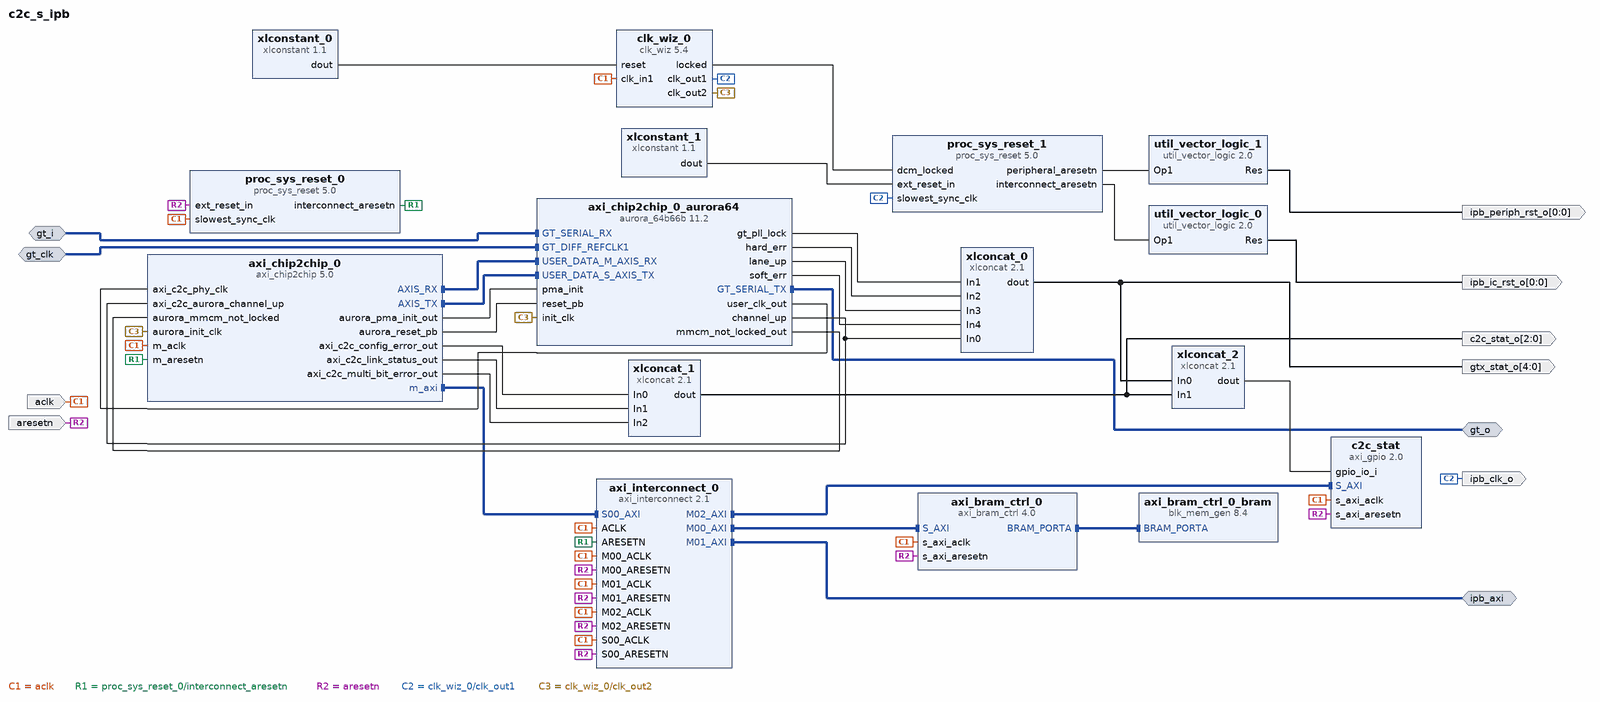
[diagram p0: block diagram of the top level]
# Vivado block design c2c_s_ipb, xczu9eg-ffvb1156-2-e, Vivado 2017.4.1
create_bd_design c2c_s_ipb

create_bd_intf_port -mode Master -vlnv xilinx.com:display_aurora:GT_Serial_Transceiver_Pins_TX_rtl:1.0 gt_o
create_bd_intf_port -mode Slave -vlnv xilinx.com:display_aurora:GT_Serial_Transceiver_Pins_RX_rtl:1.0 gt_i
create_bd_intf_port -mode Slave -vlnv xilinx.com:interface:diff_clock_rtl:1.0 gt_clk
set_property -dict {CONFIG.FREQ_HZ 156250000} [get_bd_intf_ports gt_clk]
create_bd_intf_port -mode Master -vlnv xilinx.com:interface:aximm_rtl:1.0 ipb_axi
set_property -dict [list \
  CONFIG.DATA_WIDTH 64 \
  CONFIG.PROTOCOL AXI4 \
  CONFIG.FREQ_HZ 124987000 \
  CONFIG.ADDR_WIDTH 32 \
  CONFIG.HAS_LOCK 0 \
  CONFIG.HAS_CACHE 0 \
  CONFIG.HAS_QOS 0 \
  CONFIG.HAS_REGION 0 \
  CONFIG.NUM_READ_OUTSTANDING 16 \
  CONFIG.NUM_WRITE_OUTSTANDING 16 \
] [get_bd_intf_ports ipb_axi]
create_bd_port -dir I -type clk aclk
set_property -dict {CONFIG.FREQ_HZ 124987000 CONFIG.ASSOCIATED_BUSIF ipb_axi CONFIG.ASSOCIATED_RESET aresetn} [get_bd_ports aclk]
create_bd_port -dir I -type rst aresetn
create_bd_port -dir O -type clk ipb_clk_o
set_property -dict {CONFIG.FREQ_HZ 31231165} [get_bd_ports ipb_clk_o]
create_bd_port -dir O -from 0 -to 0 ipb_ic_rst_o
create_bd_port -dir O -from 0 -to 0 ipb_periph_rst_o
create_bd_port -dir O -from 4 -to 0 gtx_stat_o
create_bd_port -dir O -from 2 -to 0 c2c_stat_o

create_bd_cell -type ip -vlnv xilinx.com:ip:axi_chip2chip:5.0 axi_chip2chip_0
set_property -dict [list \
  CONFIG.C_AXI_STB_WIDTH 8 \
  CONFIG.C_M_AXI_WUSER_WIDTH 0 \
  CONFIG.C_M_AXI_ID_WIDTH 0 \
  CONFIG.C_AXI_DATA_WIDTH 64 \
  CONFIG.C_INTERFACE_MODE 1 \
  CONFIG.C_INTERFACE_TYPE 2 \
  CONFIG.C_MASTER_FPGA 0 \
  CONFIG.C_SUPPORT_NARROWBURST true \
  CONFIG.C_EN_AXI_LINK_HNDLR true \
] [get_bd_cells axi_chip2chip_0]
create_bd_cell -type ip -vlnv xilinx.com:ip:axi_bram_ctrl:4.0 axi_bram_ctrl_0
set_property -dict {CONFIG.DATA_WIDTH 64 CONFIG.SINGLE_PORT_BRAM 1} [get_bd_cells axi_bram_ctrl_0]
create_bd_cell -type ip -vlnv xilinx.com:ip:axi_interconnect:2.1 axi_interconnect_0
set_property -dict {CONFIG.NUM_MI 3} [get_bd_cells axi_interconnect_0]
create_bd_cell -type ip -vlnv xilinx.com:ip:aurora_64b66b:11.2 axi_chip2chip_0_aurora64
set_property -dict [list \
  CONFIG.CHANNEL_ENABLE X1Y10 \
  CONFIG.C_AURORA_LANES 1 \
  CONFIG.C_LINE_RATE 5 \
  CONFIG.interface_mode Streaming \
  CONFIG.C_START_QUAD Quad_X1Y2 \
  CONFIG.C_START_LANE X1Y10 \
  CONFIG.C_REFCLK_SOURCE MGTREFCLK0_of_Quad_X1Y2 \
  CONFIG.drp_mode Disabled \
  CONFIG.SupportLevel 1 \
] [get_bd_cells axi_chip2chip_0_aurora64]
create_bd_cell -type ip -vlnv xilinx.com:ip:proc_sys_reset:5.0 proc_sys_reset_0
create_bd_cell -type ip -vlnv xilinx.com:ip:blk_mem_gen:8.4 axi_bram_ctrl_0_bram
create_bd_cell -type ip -vlnv xilinx.com:ip:clk_wiz:5.4 clk_wiz_0
set_property -dict [list \
  CONFIG.PRIM_IN_FREQ 124.987 \
  CONFIG.CLKIN1_JITTER_PS 80.0 \
  CONFIG.CLKOUT2_USED true \
  CONFIG.NUM_OUT_CLKS 2 \
  CONFIG.CLKOUT1_REQUESTED_OUT_FREQ 31.24 \
  CONFIG.CLKOUT2_REQUESTED_OUT_FREQ 62.48 \
  CONFIG.OVERRIDE_MMCM false \
  CONFIG.MMCM_DIVCLK_DIVIDE 5 \
  CONFIG.MMCM_CLKFBOUT_MULT_F 62.625 \
  CONFIG.MMCM_CLKIN1_PERIOD 8.001 \
  CONFIG.MMCM_CLKIN2_PERIOD 10.000 \
  CONFIG.MMCM_CLKOUT0_DIVIDE_F 50.125 \
  CONFIG.MMCM_CLKOUT1_DIVIDE 25 \
  CONFIG.CLKOUT1_JITTER 152.375 \
  CONFIG.CLKOUT1_PHASE_ERROR 222.296 \
  CONFIG.CLKOUT2_JITTER 138.880 \
  CONFIG.CLKOUT2_PHASE_ERROR 222.296 \
] [get_bd_cells clk_wiz_0]
create_bd_cell -type ip -vlnv xilinx.com:ip:xlconstant:1.1 xlconstant_0
set_property -dict {CONFIG.CONST_VAL 0} [get_bd_cells xlconstant_0]
create_bd_cell -type ip -vlnv xilinx.com:ip:proc_sys_reset:5.0 proc_sys_reset_1
create_bd_cell -type ip -vlnv xilinx.com:ip:util_vector_logic:2.0 util_vector_logic_0
set_property -dict {CONFIG.C_SIZE 1 CONFIG.C_OPERATION not} [get_bd_cells util_vector_logic_0]
create_bd_cell -type ip -vlnv xilinx.com:ip:util_vector_logic:2.0 util_vector_logic_1
set_property -dict {CONFIG.C_SIZE 1 CONFIG.C_OPERATION not} [get_bd_cells util_vector_logic_1]
create_bd_cell -type ip -vlnv xilinx.com:ip:xlconstant:1.1 xlconstant_1
set_property -dict {CONFIG.CONST_VAL 1} [get_bd_cells xlconstant_1]
create_bd_cell -type ip -vlnv xilinx.com:ip:xlconcat:2.1 xlconcat_0
set_property -dict {CONFIG.NUM_PORTS 5} [get_bd_cells xlconcat_0]
create_bd_cell -type ip -vlnv xilinx.com:ip:axi_gpio:2.0 c2c_stat
set_property -dict [list \
  CONFIG.C_GPIO_WIDTH 8 \
  CONFIG.C_IS_DUAL 0 \
  CONFIG.C_ALL_INPUTS 1 \
  CONFIG.USE_BOARD_FLOW true \
  CONFIG.GPIO_BOARD_INTERFACE Custom \
  CONFIG.GPIO2_BOARD_INTERFACE Custom \
] [get_bd_cells c2c_stat]
create_bd_cell -type ip -vlnv xilinx.com:ip:xlconcat:2.1 xlconcat_1
set_property -dict {CONFIG.NUM_PORTS 3} [get_bd_cells xlconcat_1]
create_bd_cell -type ip -vlnv xilinx.com:ip:xlconcat:2.1 xlconcat_2
set_property -dict {CONFIG.NUM_PORTS 2 CONFIG.IN0_WIDTH 5 CONFIG.IN1_WIDTH 3} [get_bd_cells xlconcat_2]

# ---- connections ----

connect_bd_intf_net [get_bd_intf_pins axi_chip2chip_0/m_axi] [get_bd_intf_pins axi_interconnect_0/S00_AXI]
connect_bd_intf_net [get_bd_intf_pins axi_interconnect_0/M00_AXI] [get_bd_intf_pins axi_bram_ctrl_0/S_AXI]
connect_bd_intf_net [get_bd_intf_pins axi_chip2chip_0/AXIS_RX] [get_bd_intf_pins axi_chip2chip_0_aurora64/USER_DATA_M_AXIS_RX]
connect_bd_intf_net [get_bd_intf_pins axi_chip2chip_0/AXIS_TX] [get_bd_intf_pins axi_chip2chip_0_aurora64/USER_DATA_S_AXIS_TX]
connect_bd_intf_net [get_bd_intf_pins axi_bram_ctrl_0_bram/BRAM_PORTA] [get_bd_intf_pins axi_bram_ctrl_0/BRAM_PORTA]
connect_bd_intf_net [get_bd_intf_pins axi_interconnect_0/M02_AXI] [get_bd_intf_pins c2c_stat/S_AXI]
connect_bd_intf_net [get_bd_intf_ports gt_o] [get_bd_intf_pins axi_chip2chip_0_aurora64/GT_SERIAL_TX]
connect_bd_intf_net [get_bd_intf_ports gt_i] [get_bd_intf_pins axi_chip2chip_0_aurora64/GT_SERIAL_RX]
connect_bd_intf_net [get_bd_intf_ports gt_clk] [get_bd_intf_pins axi_chip2chip_0_aurora64/GT_DIFF_REFCLK1]
connect_bd_intf_net [get_bd_intf_ports ipb_axi] [get_bd_intf_pins axi_interconnect_0/M01_AXI]
connect_bd_net [get_bd_pins axi_chip2chip_0_aurora64/user_clk_out] [get_bd_pins axi_chip2chip_0/axi_c2c_phy_clk]
connect_bd_net [get_bd_pins axi_chip2chip_0_aurora64/channel_up] [get_bd_pins axi_chip2chip_0/axi_c2c_aurora_channel_up] [get_bd_pins xlconcat_0/In0]
connect_bd_net [get_bd_pins axi_chip2chip_0_aurora64/mmcm_not_locked_out] [get_bd_pins axi_chip2chip_0/aurora_mmcm_not_locked]
connect_bd_net [get_bd_pins axi_chip2chip_0/aurora_pma_init_out] [get_bd_pins axi_chip2chip_0_aurora64/pma_init]
connect_bd_net [get_bd_pins axi_chip2chip_0/aurora_reset_pb] [get_bd_pins axi_chip2chip_0_aurora64/reset_pb]
connect_bd_net -net m_aclk_0_1 [get_bd_ports aclk] \
  [get_bd_pins axi_chip2chip_0/m_aclk] [get_bd_pins proc_sys_reset_0/slowest_sync_clk] \
  [get_bd_pins axi_bram_ctrl_0/s_axi_aclk] [get_bd_pins clk_wiz_0/clk_in1] [get_bd_pins c2c_stat/s_axi_aclk] \
  [get_bd_pins axi_interconnect_0/M00_ACLK] [get_bd_pins axi_interconnect_0/M01_ACLK] [get_bd_pins axi_interconnect_0/ACLK] \
  [get_bd_pins axi_interconnect_0/S00_ACLK] [get_bd_pins axi_interconnect_0/M02_ACLK]
connect_bd_net [get_bd_pins proc_sys_reset_0/interconnect_aresetn] [get_bd_pins axi_chip2chip_0/m_aresetn] [get_bd_pins axi_interconnect_0/ARESETN]
connect_bd_net [get_bd_ports aresetn] \
  [get_bd_pins proc_sys_reset_0/ext_reset_in] [get_bd_pins axi_bram_ctrl_0/s_axi_aresetn] \
  [get_bd_pins c2c_stat/s_axi_aresetn] [get_bd_pins axi_interconnect_0/M00_ARESETN] \
  [get_bd_pins axi_interconnect_0/M01_ARESETN] [get_bd_pins axi_interconnect_0/S00_ARESETN] \
  [get_bd_pins axi_interconnect_0/M02_ARESETN]
connect_bd_net [get_bd_pins xlconstant_0/dout] [get_bd_pins clk_wiz_0/reset]
connect_bd_net [get_bd_pins clk_wiz_0/clk_out1] [get_bd_ports ipb_clk_o] [get_bd_pins proc_sys_reset_1/slowest_sync_clk]
connect_bd_net [get_bd_pins clk_wiz_0/locked] [get_bd_pins proc_sys_reset_1/dcm_locked]
connect_bd_net [get_bd_pins proc_sys_reset_1/interconnect_aresetn] [get_bd_pins util_vector_logic_0/Op1]
connect_bd_net [get_bd_pins proc_sys_reset_1/peripheral_aresetn] [get_bd_pins util_vector_logic_1/Op1]
connect_bd_net [get_bd_pins util_vector_logic_0/Res] [get_bd_ports ipb_ic_rst_o]
connect_bd_net [get_bd_pins util_vector_logic_1/Res] [get_bd_ports ipb_periph_rst_o]
connect_bd_net [get_bd_pins xlconstant_1/dout] [get_bd_pins proc_sys_reset_1/ext_reset_in]
connect_bd_net [get_bd_pins axi_chip2chip_0_aurora64/gt_pll_lock] [get_bd_pins xlconcat_0/In1]
connect_bd_net [get_bd_pins axi_chip2chip_0_aurora64/hard_err] [get_bd_pins xlconcat_0/In2]
connect_bd_net [get_bd_pins axi_chip2chip_0_aurora64/lane_up] [get_bd_pins xlconcat_0/In3]
connect_bd_net [get_bd_pins clk_wiz_0/clk_out2] [get_bd_pins axi_chip2chip_0_aurora64/init_clk] [get_bd_pins axi_chip2chip_0/aurora_init_clk]
connect_bd_net [get_bd_pins xlconcat_0/dout] [get_bd_ports gtx_stat_o] [get_bd_pins xlconcat_2/In0]
connect_bd_net [get_bd_pins axi_chip2chip_0/axi_c2c_config_error_out] [get_bd_pins xlconcat_1/In0]
connect_bd_net [get_bd_pins axi_chip2chip_0/axi_c2c_link_status_out] [get_bd_pins xlconcat_1/In1]
connect_bd_net [get_bd_pins axi_chip2chip_0/axi_c2c_multi_bit_error_out] [get_bd_pins xlconcat_1/In2]
connect_bd_net [get_bd_pins xlconcat_1/dout] [get_bd_ports c2c_stat_o] [get_bd_pins xlconcat_2/In1]
connect_bd_net [get_bd_pins axi_chip2chip_0_aurora64/soft_err] [get_bd_pins xlconcat_0/In4]
connect_bd_net [get_bd_pins xlconcat_2/dout] [get_bd_pins c2c_stat/gpio_io_i]

# ---- address map ----
assign_bd_address -offset 0xA1001000 -range 4K -target_address_space [get_bd_addr_spaces axi_chip2chip_0/MAXI] [get_bd_addr_segs c2c_stat/S_AXI/Reg]
assign_bd_address -offset 0xA1010000 -range 64K -target_address_space [get_bd_addr_spaces axi_chip2chip_0/MAXI] [get_bd_addr_segs ipb_axi/Reg]
assign_bd_address -offset 0xA1100000 -range 64K -target_address_space [get_bd_addr_spaces axi_chip2chip_0/MAXI] [get_bd_addr_segs axi_bram_ctrl_0/S_AXI/Mem0]

validate_bd_design
save_bd_design
